# EAGLE design Brake_rev01 (EAGLE 6.5.0)
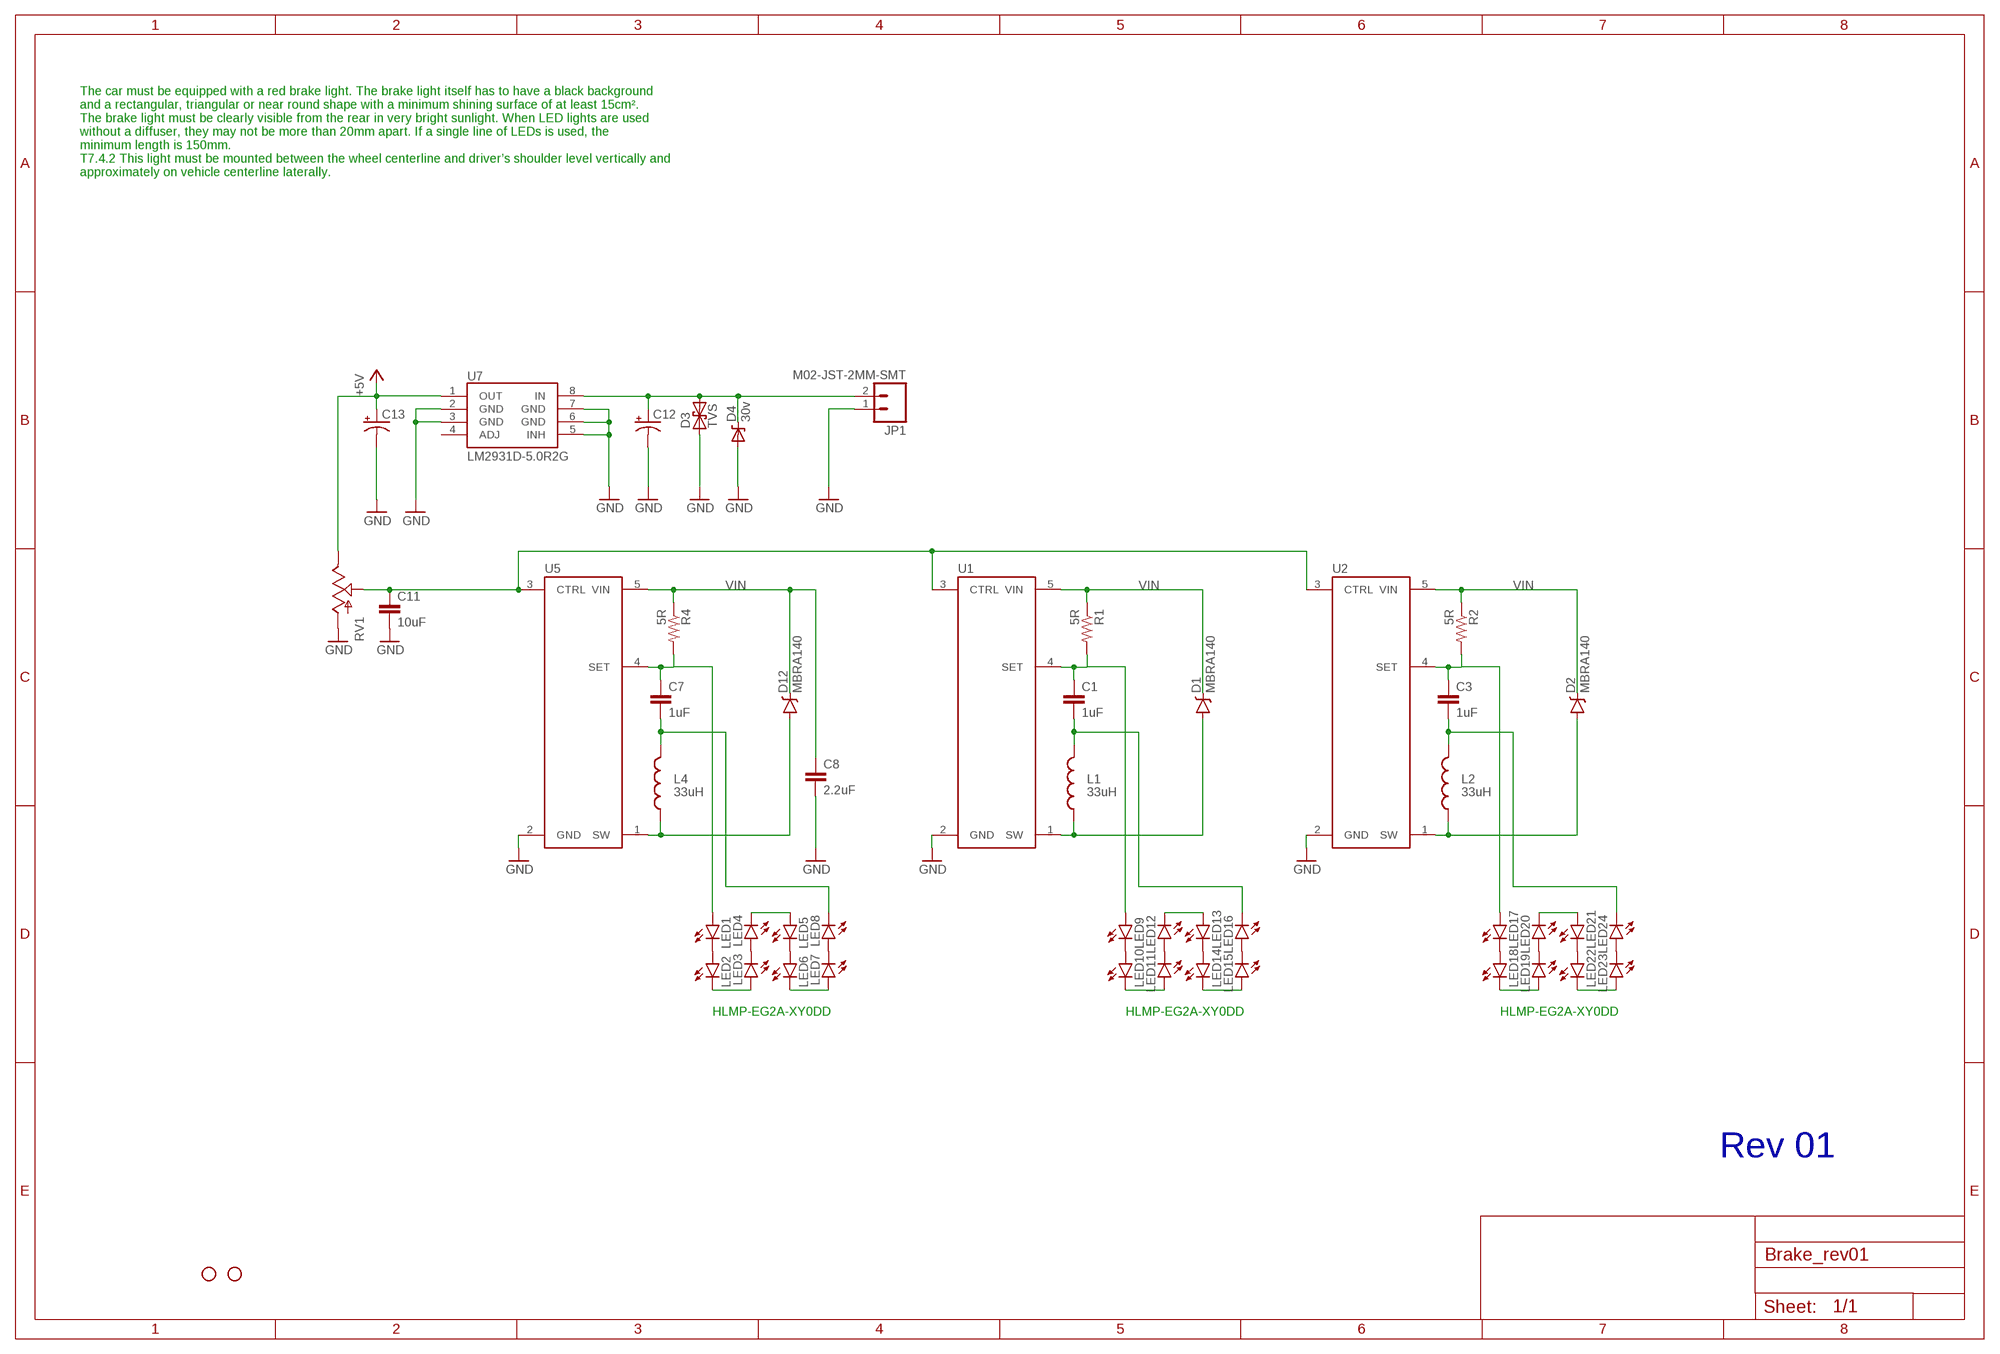
[diagram p0: schematic, sheet 1]

## Parts
C1  1uF  1.0UF50V10%(1206)  [1206]
C3  1uF  1.0UF50V10%(1206)  [1206]
C7  1uF  1.0UF50V10%(1206)  [1206]
C8  2.2uF  2.2UF50V10%(1206)  [1206]
C11  10uF  CAP0805  [0805]
C12  CAP_POL6032  [EIA6032]
C13  CAP_POL1206  [EIA3216]
D1  MBRA140  DIODE-SCHOTTKY-MBRA140  [SMA-DIODE]
D2  MBRA140  DIODE-SCHOTTKY-MBRA140  [SMA-DIODE]
D3  TVS  [SMA-DIODE]
D4  30v  DIODE-ZENERSMB  [SMB-DIODE]
D12  MBRA140  DIODE-SCHOTTKY-MBRA140  [SMA-DIODE]
JP1  M02-JST-2MM-SMT  [JST-2-SMD]
L1  33uH  INDUCTORBOURNS_SRN6045  [SRN6045]
L2  33uH  INDUCTORBOURNS_SRN6045  [SRN6045]
L4  33uH  INDUCTORBOURNS_SRN6045  [SRN6045]
LED1  LED5MM  [LED5MM]
LED2  LED5MM  [LED5MM]
LED3  LED5MM  [LED5MM]
LED4  LED5MM  [LED5MM]
LED5  LED5MM  [LED5MM]
LED6  LED5MM  [LED5MM]
LED7  LED5MM  [LED5MM]
LED8  LED5MM  [LED5MM]
LED9  LED5MM  [LED5MM]
LED10  LED5MM  [LED5MM]
LED11  LED5MM  [LED5MM]
LED12  LED5MM  [LED5MM]
LED13  LED5MM  [LED5MM]
LED14  LED5MM  [LED5MM]
LED15  LED5MM  [LED5MM]
LED16  LED5MM  [LED5MM]
LED17  LED5MM  [LED5MM]
LED18  LED5MM  [LED5MM]
LED19  LED5MM  [LED5MM]
LED20  LED5MM  [LED5MM]
LED21  LED5MM  [LED5MM]
LED22  LED5MM  [LED5MM]
LED23  LED5MM  [LED5MM]
LED24  LED5MM  [LED5MM]
R1  5R  0.3OHM-1/8W-1%(0805)  [0805]
R2  5R  0.3OHM-1/8W-1%(0805)  [0805]
R4  5R  0.3OHM-1/8W-1%(0805)  [0805]
RV1  POTTRIM  [TRIM_POT]
STANDOFF1  STAND-OFF  [STAND-OFF]
STANDOFF2  STAND-OFF  [STAND-OFF]
U1  AL8805  [SOT23-5]
U2  AL8805  [SOT23-5]
U5  AL8805  [SOT23-5]
U7  LM2931D-5.0R2G  LM2931  [SO08]

## Nets
+5V: C13.A(+) RV1.2(E) U7.1(OUT)
GND: C8.2 C11.2 C12.P$2(-) C13.C(-) D3.A D4.A JP1.1 RV1.3(A) U1.2(GND) U2.2(GND) U5.2(GND) U7.2(GND) U7.3(GND) U7.5(INH) U7.6(GND) U7.7(GND)
N$1: LED1.K(C) LED2.A
N$2: LED3.K(C) LED4.A
N$3: LED5.K(C) LED6.A
N$4: LED7.K(C) LED8.A
N$5: LED10.K(C) LED11.A
N$6: LED12.K(C) LED13.A
N$7: LED14.K(C) LED15.A
N$9: LED9.K(C) LED10.A
N$10: LED11.K(C) LED12.A
N$11: LED13.K(C) LED14.A
N$12: LED15.K(C) LED16.A
N$13: LED18.K(C) LED19.A
N$14: LED20.K(C) LED21.A
N$15: LED22.K(C) LED23.A
N$16: LED17.K(C) LED18.A
N$17: LED19.K(C) LED20.A
N$18: LED21.K(C) LED22.A
N$19: LED23.K(C) LED24.A
N$21: LED2.K(C) LED3.A
N$22: LED4.K(C) LED5.A
N$23: LED6.K(C) LED7.A
N$28: C11.1 RV1.1(S) U1.3(CTRL) U2.3(CTRL) U5.3(CTRL)
OUT+1: C1.1 LED9.A R1.2 U1.4(SET)
OUT+2: C3.1 LED17.A R2.2 U2.4(SET)
OUT+3: C7.1 LED1.A R4.2 U5.4(SET)
OUT-1 [power]: C1.2 L1.2 LED16.K(C)
OUT-2 [power]: C3.2 L2.2 LED24.K(C)
OUT-3 [power]: C7.2 L4.2 LED8.K(C)
SW1: D1.A L1.1 U1.1(SW)
SW2: D2.A L2.1 U2.1(SW)
SW3: D12.A L4.1 U5.1(SW)
VIN: C8.1 C12.P$1(+) D1.C D2.C D3.C D4.C D12.C JP1.2 R1.1 R2.1 R4.1 U1.5(VIN) U2.5(VIN) U5.5(VIN) U7.8(IN)
Unconnected: U7.4(ADJ)

## Notes on the sheet
- The car must be equipped with a red brake light. The brake light itself has to have a black background
  and a rectangular, triangular or near round shape with a minimum shining surface of at least 15cm².
  The brake light must be clearly visible from the rear in very bright sunlight. When LED lights are used
  without a diffuser, they may not be more than 20mm apart. If a single line of LEDs is used, the
  minimum length is 150mm.
  T7.4.2 This light must be mounted between the wheel centerline and driver’s shoulder level vertically and
  approximately on vehicle centerline laterally.
- HLMP-EG2A-XY0DD | HLMP-EG2A-XY0DD | HLMP-EG2A-XY0DD
- Rev 01

## Library data of the parts
C1 C3 C7 = SparkFun-Capacitors:1.0UF50V10%(1206): CAP-09822; PROD_ID: CAP-09822; VALUE: 1.0uF
C8 = SparkFun-Capacitors:2.2UF50V10%(1206): CAP-10009; PROD_ID: CAP-10009; VALUE: 2.2UF
C11 = SparkFun-Capacitors:CAP: Capacitor Standard 0603 ceramic capacitor, and 0.1" leaded capacitor.
C12 C13 = SparkFun-Capacitors:CAP_POL: Capacitor Polarized These are standard SMD and PTH capacitors. Normally 10uF, 47uF, and 100uF in electrolytic and tantalum varieties. Always verify the external diameter of the through hole cap, it varies with capacity, voltage, and manufacturer. The EIA devices should be standard.
D1 D2 D12 = SparkFun-DiscreteSemi:DIODE-SCHOTTKY: Schottky diodes in SFE's production catalog BAT20J 1A 23V 0.62Vf RB751 120mA 40V 0.37Vf PMEG4005EJ 0.5A 40V 0.42Vf MBRA140 1A 40V 0.5Vf B340A 3A 40V SMA; PROD_ID: DIO-08053
D3 = SparkFun-DiscreteSemi:TVS: Transient voltage suppressor- prevents ESD on inputs. Ignore package description- MBRA140 is NOT this type of part!!!
D4 = SparkFun-DiscreteSemi:DIODE-ZENER: Zener Diode Production Part - 8199 3.4V Zener Voltage
JP1 = SparkFun-Connectors:M02: Standard 2-pin 0.1" header. Use with - straight break away headers ( PRT-00116) - right angle break away headers (PRT-00553) - swiss pins (PRT-00743) - machine pins (PRT-00117) - female headers (PRT-00115) Molex polarized connector foot print use with: PRT-08233 with associated crimp pins and housings. 2.54_SCREWTERM for use with PRT-10571. 3.5mm Screw Terminal footprints for PRT-08084 5mm Screw Terminal footprints for use with PRT-08432; PROD_ID: CONN-08352
L1 L2 L4 = SparkFun-Passives:INDUCTOR: Inductors Basic Inductor/Choke - 0603 and 1206. Footprints are not proven and vary greatly between part numbers. SRN6045- 33uH, 20% 1.4A SDR0403-560KL - 56uH, 10%, 500mA RMS/740mA peak; PROD_ID: NDUC-11627
LED1-LED24 = SparkFun-LED:LED: LEDs Standard schematic elements and footprints for 5mm, 3mm, 1206, and 0603 sized LEDs. 5mm - Spark Fun Electronics SKU : COM-00529 (and others)
R1 R2 R4 = SparkFun-Resistors:0.3OHM-1/8W-1%(0805): RES-11622; PROD_ID: RES-11622; VALUE: 0.3
RV1 = SparkFun-Electromechanical:POT
STANDOFF1 STANDOFF2 = SparkFun-Electromechanical:STAND-OFF: #4 Stand Off This is the mechanical footprint for a #4 phillips button head screw. Use the keepout ring to avoid running the screw head into surrounding components. SKU : PRT-00447
U1 U2 U5 = SparkFun-PowerIC:AL8805: Constant current LED driver PWM-able 1MHz switch freq 6V-36V Up to 1A LED current; PROD_ID: IC-11626; VALUE: AL8805WS
U7 = SparkFun-PowerIC:LM2931: LDO regulator with reverse battery protection- very durable!

## Net classes
0 default: width 0.254 mm
1 power: width 0.508 mm

## Board
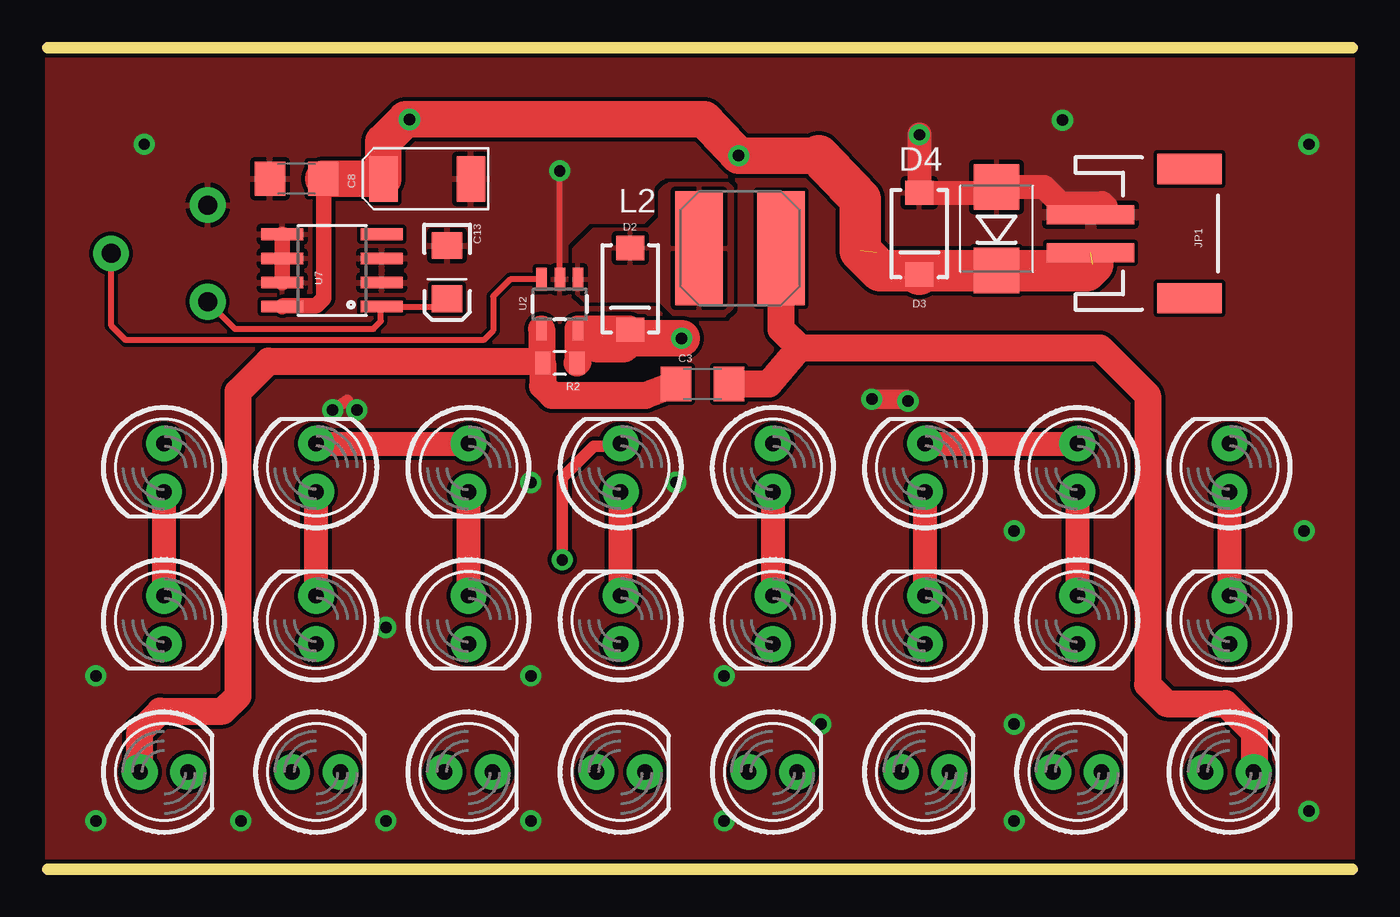
[diagram p1: board, top side]
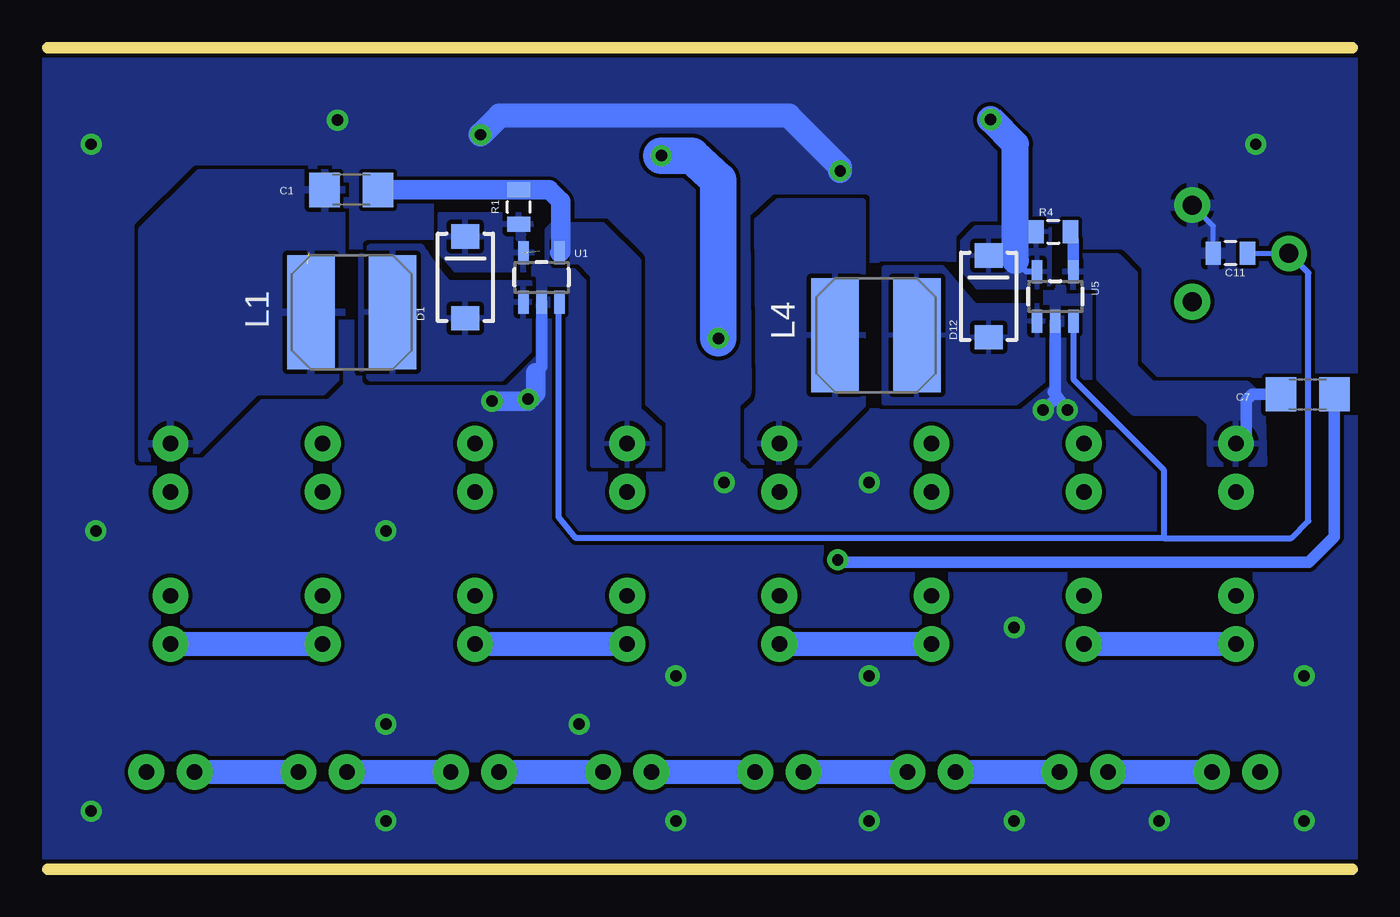
[diagram p2: board, bottom side, seen from below]

Size 68.58 x 43.18 mm. Coordinates in mm from the lower left corner, seen from the top.
Outline: 0,43.18 68.58,43.18
Outline: 68.58,0 0,0
Copper layers (1*16): Top 0.035mm / dielectric 1.5mm / Bottom 0.035mm
Design rules "Sparkfun": minimum track width 8mil, minimum drill 20mil, track to track 8mil, track to pad 8mil, pad to pad 8mil, via to via 8mil, smd to smd 8mil, copper to edge 8mil, drill to drill 8mil, minimum pad ring 12mil, minimum via ring 10mil, stop-mask expansion 4mil, vias tented up to drill 20mil, thermal gap 10mil

### Footprints (pad centres in the part's own frame; a part is rotated, then mirrored left to right if it is on the bottom)
1206 = smd 1.6 x 1.8: 1 -1.4,0; 2 1.4,0
0805 = smd 0.8 x 1.2: 1 -0.9,0; 2 0.9,0
EIA6032 = smd 1.5 x 2.4: P$1 -2.3,0; P$2 2.3,0
EIA3216 = smd 1.4 x 1.6: A 1.4,0; C -1.4,0
SMA-DIODE = smd 1.27 x 1.47: A -2.15,0; C 2.15,0
SMB-DIODE = smd 2.4 x 2.4: A 2.2,0; C -2.2,0
JST-2-SMD = smd 1 x 4.6: 1 -1,-3.7; 2 1,-3.7 | smd 1.6 x 3.4: NC1 -3.4,1.5; NC2 3.4,1.5
SRN6045 = smd 2.5 x 6: 1 -2.175,-0.175; 2 2.125,-0.175
LED5MM = drill 0.813 pad 1.88: A -1.27,0; K 1.27,0
TRIM_POT = drill 1 pad 1.88: 1 5.08,0; 2 0,2.54; 3 0,-2.54
STAND-OFF = hole 3.302: 0,0
SOT23-5 = smd 0.55 x 1.2: 1 -0.95,-1.3; 2 0,-1.3; 3 0.95,-1.3; 4 0.95,1.3; 5 -0.95,1.3
SO08 = smd 0.61 x 2.21: 1 -1.905,-2.616; 2 -0.635,-2.616; 3 0.635,-2.616; 4 1.905,-2.616; 5 1.905,2.616; 6 0.635,2.616; 7 -0.635,2.616; 8 -1.905,2.616

### Placement (x,y rotation side)
C1  52.62,35.7 180 bottom
C3  34.42,25.5 0 top
C7  2.35,24.96 0 bottom
C8  13.09,36.29 180 top
C11  6.41,32.38 180 bottom
C12  19.95,36.28 0 top
C13  21,31.38 270 top
D1  46.62,31.1 90 bottom
D2  30.62,30.5 270 top
D3  45.82,33.4 270 top
D4  49.88,33.66 90 top
D12  19.12,30.1 90 bottom
JP1  58.52,33.4 270 top
L1  52.62,29.1 180 bottom
L2  36.42,32.8 0 top
L4  25.06,27.88 180 bottom
LED1  6.12,21.1 270 top
LED2  6.12,13.1 270 top
LED3  14.12,13.1 90 top
LED4  14.12,21.1 90 top
LED5  22.12,21.1 270 top
LED6  22.12,13.1 270 top
LED7  30.12,13.1 90 top
LED8  30.12,21.1 90 top
LED9  38.12,21.1 270 top
LED10  38.12,13.1 270 top
LED11  46.12,13.1 90 top
LED12  46.12,21.1 90 top
LED13  54.12,21.1 270 top
LED14  54.12,13.1 270 top
LED15  62.12,13.1 90 top
LED16  62.12,21.1 90 top
LED17  6.12,5.1 0 top
LED18  14.12,5.1 0 top
LED19  22.12,5.1 0 top
LED20  30.12,5.1 0 top
LED21  38.12,5.1 0 top
LED22  46.12,5.1 0 top
LED23  54.12,5.1 0 top
LED24  62.12,5.1 0 top
R1  43.82,34.8 90 bottom
R2  26.92,26.6 180 top
R4  15.72,33.5 0 bottom
RV1  8.42,32.36 180 top
STANDOFF1  -7.62,21.59 0 top  (outside the outline)
STANDOFF2  76.2,21.59 0 top  (outside the outline)
U1  42.62,31.1 0 bottom
U2  26.92,29.7 180 top
U5  15.62,30.1 0 bottom
U7  14.95,31.47 90 top

### Tracks (layer width: path | path; a pad name or v marks a point on that pad's centre or on a via)
+5V
  Top 0.305: C13.A 20.59,29.56 U7.1 17.52,29.51 17.52,28.8 17.12,28.4 9.84,28.4 RV1.2
GND  (via drill 0.6)
  Top 0.305: U2.2 v26.92,36.7 | RV1.3 8.52,34.8
  Top 0.61: v14.99,24.13 15.75,24.64 arc30 v16.26,24.13
  Top 0.813: U7.7 U7.6 U7.5
  Top 1.016: v43.32,24.7 45.12,24.7 v45.22,24.6
  Top 1.27: v45.82,38.6 D3.A 49.58,35.55 D4.A 52.36,35.86 53.22,35 55.42,35 55.62,34.8 55.02,34.8 54.92,34.9
  Bottom 0.254: C11.2 7.31,33.79 RV1.3
  Bottom 0.61: U1.2 42.62,26.4 42.92,26.1 | U5.2 15.62,25.1 | 15.62,25.1 15.72,25.1 v14.99,24.13 | v16.26,24.13 15.62,24.7 15.62,25.1
  Bottom 1.016: 42.92,26.1 42.92,25.1 v43.32,24.7 | v45.22,24.6 43.32,24.6 42.92,25
  Bottom 1.27: v26.92,36.7 26.92,36.9 29.62,39.6 44.82,39.6 v45.82,38.6
  other vias: 66.04,17.78 5.08,38.1 25.4,20.32 33.02,20.32 17.78,12.7 2.54,10.16 2.54,2.54 10.16,2.54 17.78,2.54 25.4,10.16 25.4,2.54 35.56,2.54 35.56,10.16 40.64,7.62 50.8,2.54 50.8,7.62 50.8,17.78 66.29,38.1 53.34,39.37 66.29,3.05
  pour Top: 15.92,31 15.92,33.6 16.52,34.2 20.32,34.2 20.62,34.5 20.62,36.9 21.32,37.6 31.12,37.6 31.42,37.3 31.42,34.8 30.92,34.3 28.32,34.3 27.22,33.2 27.22,31 26.92,30.7 26.82,30.7 26.72,30.8 26.72,32 26.42,32.3 22.42,32.3 22.12,32 19.72,32 19.02,31.3 19.02,30.8 18.72,30.5 16.42,30.5
  pour Top: 2.62,37.5 12.12,37.5 12.62,37 12.62,35.2 13.32,34.5 13.32,30.9 13.12,30.7 2.62,30.7 2.02,31.3 2.02,36.9
  pour Top (rank 5): 0,43.18 68.58,43.18 68.58,0 0,0
  pour Top: 58.82,25.3 58.82,32.5 57.42,33.9 52.82,33.9 52.42,34.3 52.42,36.6 52.92,37.1 64.42,37.1 66.12,35.4 66.12,25.7 65.82,25.4 58.92,25.4
  pour Bottom (rank 5): 0,43.18 68.58,43.18 68.58,0 0,0
N$1
  Top 1.27: LED2.A LED1.K
N$2
  Top 1.27: LED3.K LED4.A
N$3
  Top 1.27: LED5.K LED6.A
N$4
  Top 1.27: LED7.K LED8.A
N$5
  Bottom 1.27: LED10.K LED11.A
N$6
  Top 1.27: LED12.K LED13.A
N$7
  Bottom 1.27: LED14.K LED15.A
N$9
  Top 1.27: LED9.K LED10.A
N$10
  Top 1.27: LED11.K LED12.A
N$11
  Top 1.27: LED13.K LED14.A
N$12
  Top 1.27: LED15.K LED16.A
N$13
  Bottom 1.27: LED18.K LED19.A
N$14
  Bottom 1.27: LED20.K LED21.A
N$15
  Bottom 1.27: LED22.K LED23.A
N$16
  Bottom 1.27: LED17.K LED18.A
N$17
  Bottom 1.27: LED19.K LED20.A
N$18
  Bottom 1.27: LED21.K LED22.A
N$19
  Bottom 1.27: LED23.K LED24.A
N$21
  Bottom 1.27: LED2.K LED3.A
N$22
  Top 1.27: LED4.K LED5.A
N$23
  Bottom 1.27: LED6.K LED7.A
N$28  (via drill 0.6)
  Top 0.305: U2.3 24.32,31 23.42,30.1 23.42,28.3 22.92,27.8 4.12,27.8 3.35,28.57 3.35,32.35 RV1.1
  Bottom 0.254: C11.1 v3.35,32.38 RV1.1
  Bottom 0.305: 9.92,17.4 40.82,17.4 41.72,18.5 41.72,29.75 U1.3 | U5.3 14.67,25.75 9.92,21 9.92,17.4 | 9.92,17.4 3.22,17.4 2.32,18.3 2.32,31.34 v3.35,32.38
OUT+1
  Bottom 1.016: C1.1 R1.2 42.22,35.7 41.62,35.1 41.62,32.45 U1.4
  pour Bottom: 39.92,21.2 39.92,31.2 40.62,31.9 42.12,31.9 42.32,32.1 42.32,33.6 42.02,33.9 39.42,33.9 37.52,32 37.52,24.2 36.42,23.2 36.42,21.2
OUT+2
  Top 1.422: LED17.A 4.85,7.23 5.92,8.3 9.22,8.3 10.02,9.1 10.02,25.1 11.62,26.7 25.62,26.7 R2.2 | U2.4 25.97,26.65 R2.2 | R2.2 26.02,25.4 26.52,24.9 31.42,24.9 C3.1
OUT+3
  Bottom 0.61: U5.4 14.67,33.05 R4.2 | C7.1 5.27,24.96 5.59,24.64 5.59,22.73 6.1,22.23 5.97,22.23 6.22,22.48
  pour Bottom: 4.62,21.3 4.72,24.7 5.52,25.5 10.52,25.5 11.42,26.4 11.42,31.3 12.32,32.2 14.92,32.2 15.12,32 15.12,30.8 14.92,30.6 13.52,30.6 13.32,30.4 13.32,25.8 11.52,24 8.12,24 7.52,23.4 7.52,21.3
OUT-1
  pour Bottom: 53.12,36.6 60.62,36.6 63.62,33.6 63.62,21.6 61.12,21.6 57.62,25.1 54.12,25.1 53.12,26.1
OUT-2
  Top 1.422: L2.2 38.55,28.38 39.52,27.4 | 39.52,27.4 55.32,27.4 57.82,24.9 57.82,9.7 58.82,8.7 61.92,8.7 63.42,7.2 63.42,5.13 LED24.K | C3.2 37.92,25.5 39.52,27.4
OUT-3  (via drill 0.6)
  Top 0.61: v27.05,16.26 27.05,20.57 28.7,22.23 29.98,22.23 LED8.K
  Bottom 0.61: C7.2 0.95,17.46 2.29,16.13 26.92,16.13 v27.05,16.26
  pour Bottom: 25.72,35.1 30.22,35.1 31.32,34.1 31.22,25 31.32,24.6 31.82,24.1 31.82,21.7 31.52,21.4 28.72,21.4 25.72,24.4
SW1
  pour Bottom: 43.22,27.3 43.22,30.8 47.52,30.8 48.02,31.4 48.72,32.4 48.92,32.7 51.62,32.7 52.12,32.2 52.12,26.3 51.62,25.8 44.72,25.8
SW2
  pour Top: 27.72,30.4 27.72,32.6 28.72,33.6 31.62,33.6 32.22,34.2 32.22,35.6 32.52,35.9 32.62,35.9 32.72,36 35.72,36 35.92,35.8 35.92,29.5 35.52,29.1 33.02,29.1 32.22,29.9 28.22,29.9
SW3
  pour Bottom: 16.22,29.6 19.82,29.6 21.52,31.6 24.62,31.6 24.62,24.5 17.67,24.5 16.22,25.7
VIN  (via drill 0.6)  (2 unrouted)
  Top 0.813: C12.P$1 14.7,36.28 14.52,36.1 14.52,30 14.12,29.6 12.38,29.6 U7.8
  Top 1.27: D2.C 28.77,28.35 28.52,28.1 28.52,28 28.92,27.6
  Top 1.422: R2.1 27.87,26.65 U2.5 30.57,28.4 D2.C
  Top 1.93: 28.92,27.6 30.22,27.6 30.52,27.9 v33.32,27.9 | 40.52,37.5 v36.32,37.5 34.52,39.4 v19.02,39.4 18.82,39.4 17.65,38.23 C12.P$1 14.5,36.28 C8.1
  Top 2.184: 46.02,31.46 D4.C 54.58,31.46 54.92,31.8 | 46.02,31.46 D3.C | 46.02,31.46 43.76,31.46 42.72,32.5 42.72,35.2 40.52,37.5
  Bottom 0.305: U5.5 17.12,31.4 17.72,32
  Bottom 1.422: 17.72,32 17.72,38.1 v19.02,39.4
  Bottom 1.93: v33.32,27.9 33.32,36.2 34.72,37.5 v36.32,37.5
  pour Bottom: 43.12,31.5 47.12,31.5 47.92,32.4 47.92,34.4 43.22,34.4
  pour Bottom: 15.92,33.7 19.82,33.7 20.52,33 20.52,31.5 19.72,30.6 16.12,30.6 15.92,30.8

### Text on the board
Notes: 4-40